# Altium project arduino_uno_PCB_Project.PrjPcb
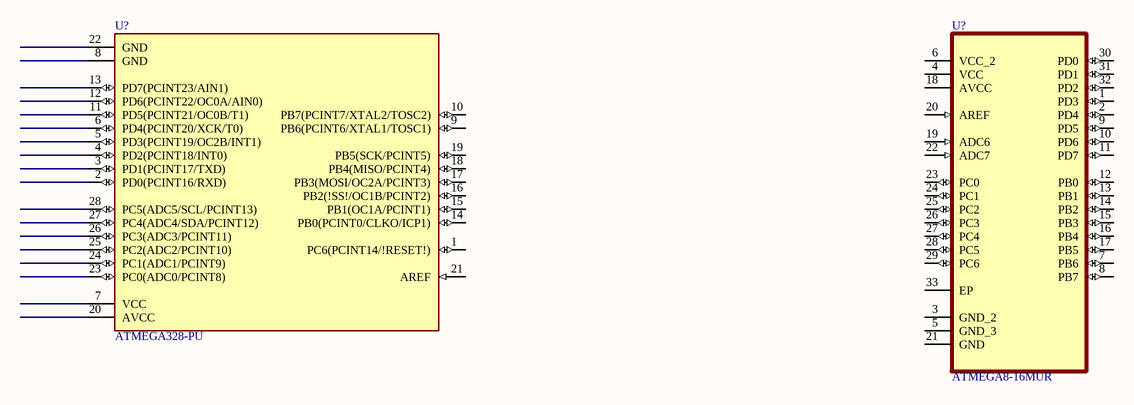
[diagram p0: Sheet1.SchDoc]
1 sheet, 2 parts. Net scope: global (net labels, ports and power ports of the same name join across sheets).
Board file: PCB1.PcbDoc

## Sheet Sheet1.SchDoc
size A3; SheetNumber: 1; SheetTotal: 1

### Parts
(Parts that share a designator on the sheet are numbered #1, #2 ... from top to bottom, then left to right.)
U?#1  ATMEGA8-16MUR  [QFN50P500X500X100-33N]
U?#2  ATMEGA328-PU  [DIP787W46P254L3467H508Q28]

### Nets

Not connected (* = marked no-connect by the designer): U?#1 1(PD3) 2(PD4) 3(GND_2) 4(VCC) 5(GND_3) 6(VCC_2) 7(PB6) 8(PB7) 9(PD5) 10(PD6) 11(PD7) 12(PB0) 13(PB1) 14(PB2) 15(PB3) 16(PB4) 17(PB5) 18(AVCC) 19(ADC6) 20(AREF) 21(GND) 22(ADC7) 23(PC0) 24(PC1) 25(PC2) 26(PC3) 27(PC4) 28(PC5) 29(PC6) 30(PD0) 31(PD1) 32(PD2) 33(EP); U?#2 1(PC6(PCINT14/!RESET!)) 2(PD0(PCINT16/RXD)) 3(PD1(PCINT17/TXD)) 4(PD2(PCINT18/INT0)) 5(PD3(PCINT19/OC2B/INT1)) 6(PD4(PCINT20/XCK/T0)) 7(VCC) 8(GND) 9(PB6(PCINT6/XTAL1/TOSC1)) 10(PB7(PCINT7/XTAL2/TOSC2)) 11(PD5(PCINT21/OC0B/T1)) 12(PD6(PCINT22/OC0A/AIN0)) 13(PD7(PCINT23/AIN1)) 14(PB0(PCINT0/CLKO/ICP1)) 15(PB1(OC1A/PCINT1)) 16(PB2(!SS!/OC1B/PCINT2)) 17(PB3(MOSI/OC2A/PCINT3)) 18(PB4(MISO/PCINT4)) 19(PB5(SCK/PCINT5)) 20(AVCC) 21(AREF) 22(GND) 23(PC0(ADC0/PCINT8)) 24(PC1(ADC1/PCINT9)) 25(PC2(ADC2/PCINT10)) 26(PC3(ADC3/PCINT11)) 27(PC4(ADC4/SDA/PCINT12)) 28(PC5(ADC5/SCL/PCINT13))

### Library data of the parts
U?#1 = ATMEGA8-16MUR: Programmable Flash; Package: None; Price: None; Value: *; MP: ATMEGA8-16MUR; Availability: Unavailable
U?#2 = ATMEGA328-PU: AVR AVRÂ® ATmega Microcontroller IC 8-Bit 20MHz 32KB (16K x 16) FLASH 28-PDIP; MF: Microchip Technology; Value: *; Check_prices: https://www.snapeda.com/parts/ATMEGA328-PU/Microchip/view-part/4833845/?ref=eda; Availability: Good; Package: DIP-28 Microchip Technology; SnapEDA_Link: https://www.snapeda.com/parts/ATMEGA328-PU/Microchip/view-part/4833845/?ref=snap; Purchase-URL: https://pricing.snapeda.com/search/part/ATMEGA328-PU/?ref=eda; Price: None; MP: ATMEGA328-PU